# Altium schematic sheet power managment.SchDoc
size A4
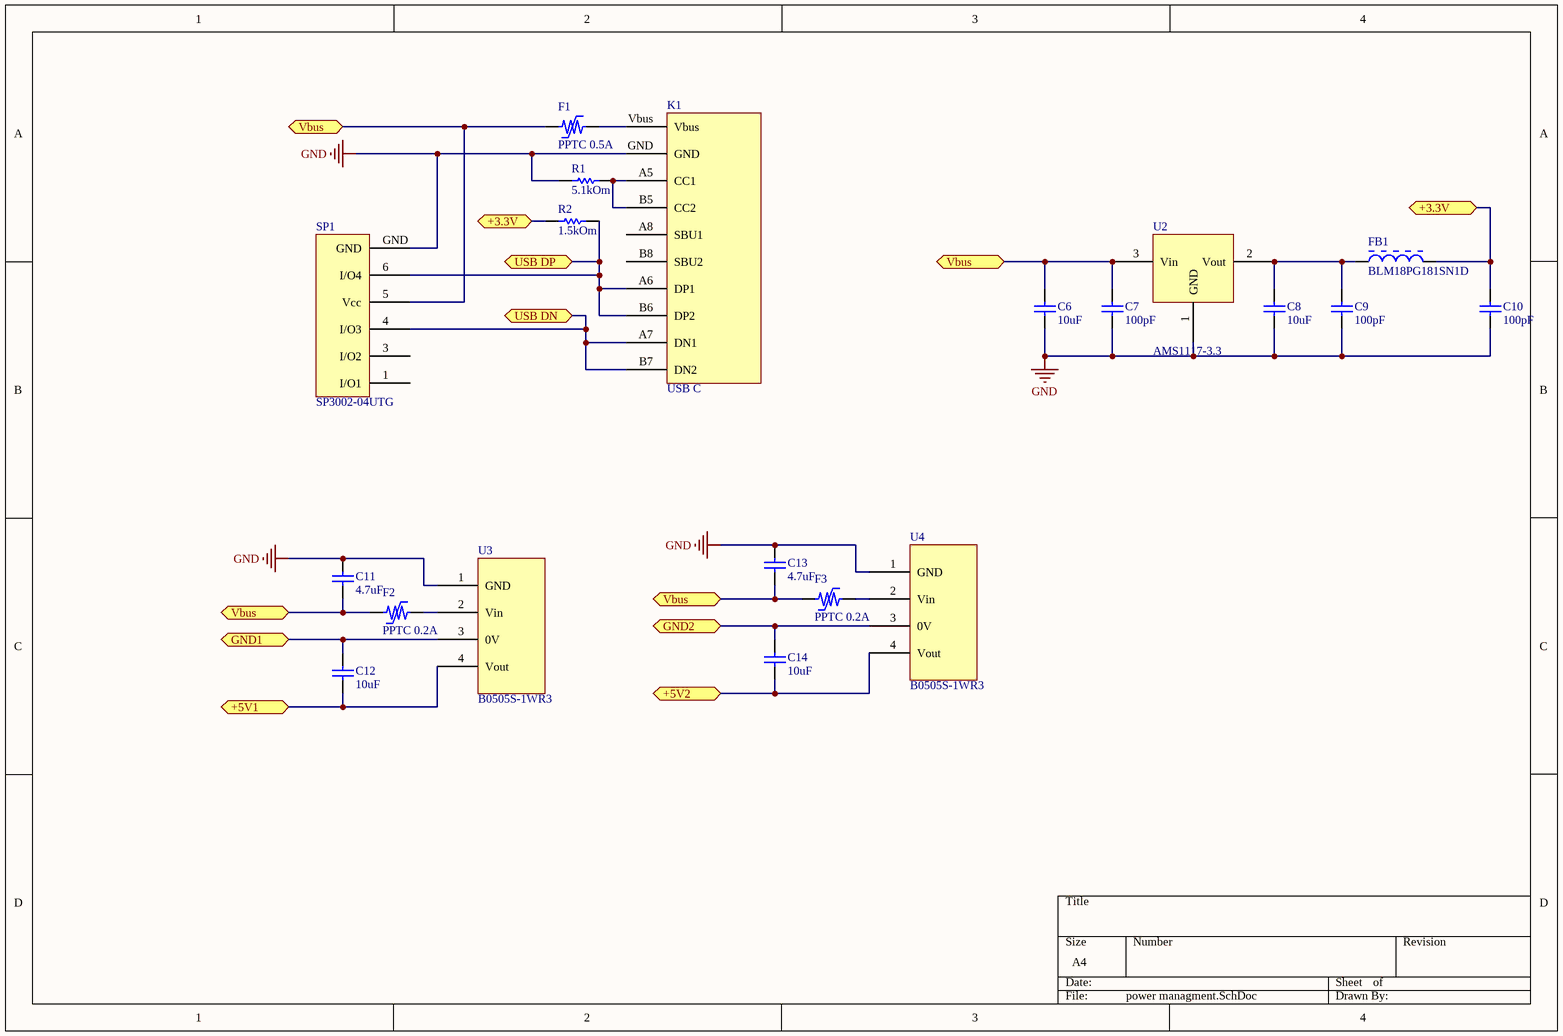
[diagram p0: power managment.SchDoc]

## Parts
C6  10uF  [CAPC1608X90X35ML10T15]
C7  100pF  [CAPC1608X90X35ML10T15]
C8  10uF  [CAPC1608X90X35ML10T15]
C9  100pF  [CAPC1608X90X35ML10T15]
C10  100pF  [CAPC1608X90X35ML10T15]
C11  4.7uF  [CAPC1608X90X35ML10T15]
C12  10uF  [CAPC1608X90X35ML10T15]
C13  4.7uF  [CAPC1608X90X35ML10T15]
C14  10uF  [CAPC1608X90X35ML10T15]
F1  PPTC 0.5A  [PTC 0603]
F2  PPTC 0.2A  [PTC 0603]
F3  PPTC 0.2A  [PTC 0603]
FB1  BLM18PG181SN1D  [MURA-BLM18PG_KG-CHIP-2_V2]
K1  USB C  [USB type C]
R1  5.1kOm  [RESC1608X55X30ML20T10]
R2  1.5kOm  [RESC1608X55X30ML20T10]
SP1  SP3002-04UTG  [uDFN-6]
U2  AMS1117-3.3  [AMS1117]
U3  B0505S-1WR3  [Dip4 package]
U4  B0505S-1WR3  [Dip4 package]

## Ports
+3.3V (bidir), +5V1 (bidir), +5V2 (bidir), GND1 (bidir), GND2 (bidir), USB DN (bidir), USB DP (bidir), Vbus (bidir)

## Nets
GND: C6.1 C7.1 C8.1 C9.1 C10.1 C11.2 C13.2 K1.GND R1.1 SP1.GND U2.1(GND) U3.1(GND) U4.1(GND)
+3.3V: C10.2 FB1.2 R2.1 ; port +3.3V
+5V1: C12.1 U3.4(Vout) ; port +5V1
+5V2: C14.1 U4.4(Vout) ; port +5V2
GND1: C12.2 U3.3(0V) ; port GND1
GND2: C14.2 U4.3(0V) ; port GND2
USB DN: K1.A7(DN1) K1.B7(DN2) SP1.4(I/O3) ; port USB DN
USB DP: K1.A6(DP1) K1.B6(DP2) R2.2 SP1.6(I/O4) ; port USB DP
Vbus: C6.2 C7.2 C11.1 C13.1 F1.1 F2.1 F3.1 SP1.5(Vcc) U2.3(Vin) ; port Vbus
NetC8_2: C8.2 C9.2 FB1.1 U2.2(Vout)
NetF1_2: F1.2 K1.Vbus
NetF2_2: F2.2 U3.2(Vin)
NetF3_2: F3.2 U4.2(Vin)
NetK1_A5: K1.A5(CC1) K1.B5(CC2) R1.2

Not connected (* = marked no-connect by the designer): K1 A8(SBU1) B8(SBU2); SP1 1(I/O1) 3(I/O2)

## Library data of the parts
C6-C14 = CMP-2006-02335-1: Manufacturer: Murata; Part Number: GCM1885C2A101JA16D
F1-F3 = PTC Resettable Fuse
FB1 = CMP-0686-00566-2: Chip Ferrite Bead for Power Lines, 180 Ohm, 1500 mA, -55 to 125 degC, 1.6 x 0.8 x 0.95 mm SMD, Tape and Reel; Manufacturer: Murata; Impedance (at 100 MHz): 180 Ohm +/- 25%; Rated Current: 1500 mA; DC Resistance: 0.09 Ohm Max.; ComponentLink3Description: Package Specification; PackageDescription: 2-Pin Chip, Body 1.6 x 0.8 mm; Mounting Technology: Surface Mount; ComponentLink1Description: Manufacturer URL; Operating Temperature Range: -55 to 125 degC; Packing: Tape and Reel; DatasheetVersion: 08/2013; ComponentLink3URL: http://www.murata.com/products/catalog/pdf/c31e.pdf; ComponentLink2Description: Datasheet; PartNumber: BLM18PG181SN1D; ComponentLink1URL: http://www.murata.com/; ComponentLink2URL: http://www.murata.com/products/catalog/pdf/c31e.pdf; PackageReference: BLM18_H950-2
R1 R2 = CMP-2000-01555-1: Part Number: RK73H1JTTD5101F; Manufacturer: KOA Speer
SP1 = SP3002-04UTG: ComponentLink1Description: New link; ComponentLink1URL: https://lcsc.com/product-detail/Others_Littelfuse_SP3002-04UTG_Littelfuse-SP3002-04UTG_C207277.html
U3 U4 = B0505S-1WR3: ComponentLink1Description: New link; ComponentLink1URL: https://lcsc.com/product-detail/Power-Modules_B0505S-1WR3_C131038.html